# EAGLE design CANreader-FT (EAGLE 7.6.0)
https://github.com/autowp/CANreader
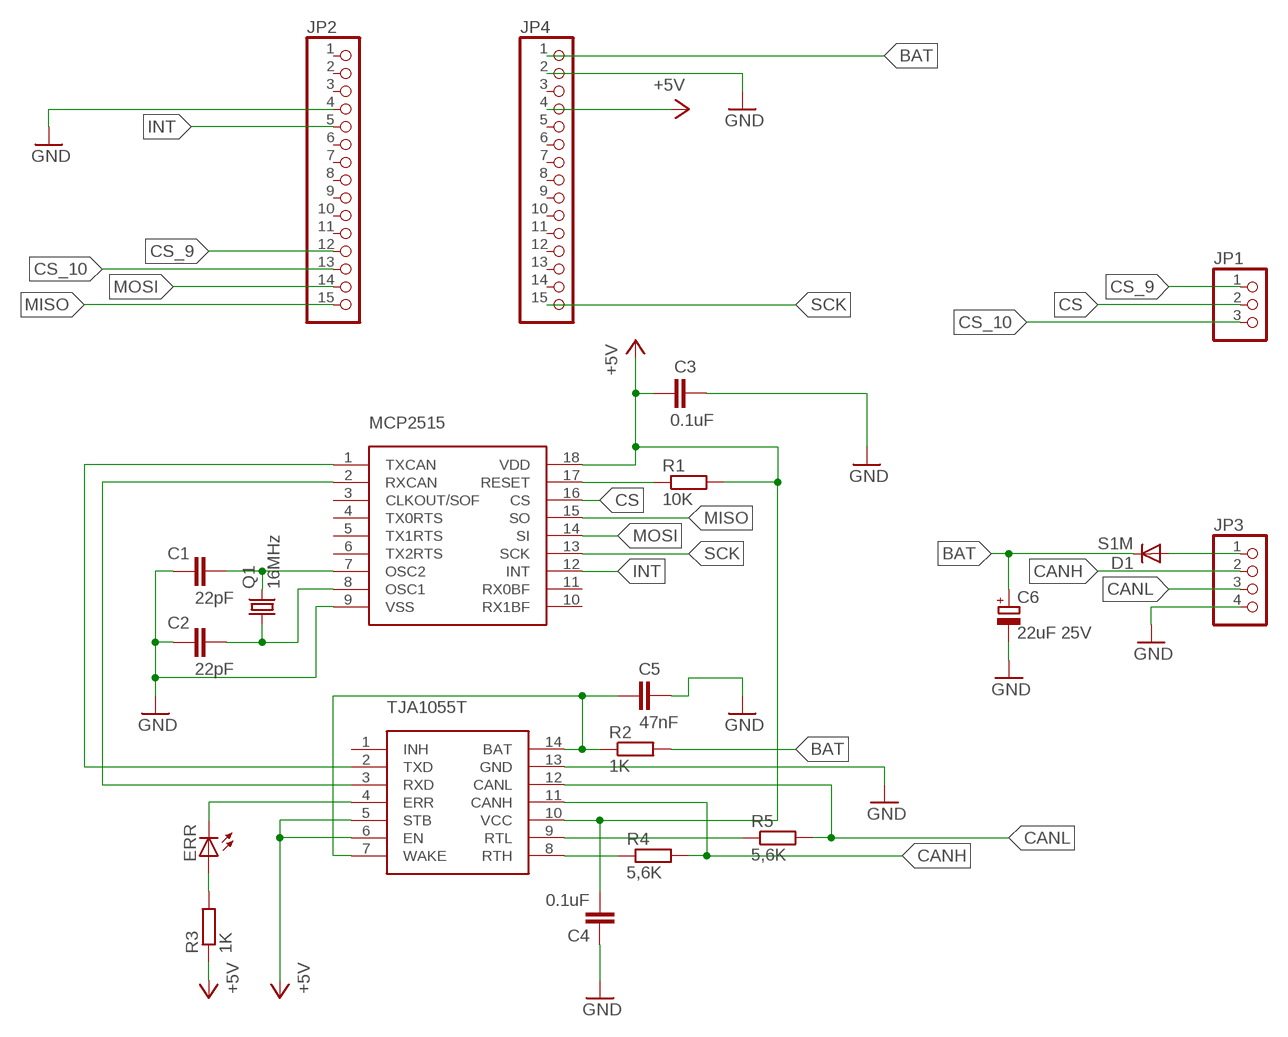
[diagram p0: schematic, sheet 1]

## Parts
C1  22pF  C-EUC0805  [C0805]
C2  22pF  C-EUC0805  [C0805]
C3  0.1uF  C-EUC0805  [C0805]
C4  0.1uF  C-EUC0805  [C0805]
C5  47nF  C-EUC0805  [C0805]
C6  22uF 25V  CPOL-EUSMCC  [SMC_C]
D1  S1M  [SMA]
ERR  LEDCHIP-LED0805  [CHIP-LED0805]
JP1  PINHD-1X3  [1X03]
JP2  PINHD-1X15  [1X15]
JP3  PINHD-1X4-1  [1X04]
JP4  PINHD-1X15  [1X15]
MCP2515  MCP2515  [SO18-1]
Q1  16MHz  CRYSTALHC49S  [HC49/S]
R1  10K  R-EU_R0805  [R0805]
R2  1K  R-EU_R0805  [R0805]
R3  1K  R-EU_R0805  [R0805]
R4  5,6K  R-EU_R0805  [R0805]
R5  5,6K  R-EU_R0805  [R0805]
TJA1055T  TJA1055T  [SO-14W]

## Nets
+5V: C3.1 C4.2 JP4.4 MCP2515.18(VDD) R1.2 R3.1 TJA1055T.5(STB) TJA1055T.6(EN) TJA1055T.10(VCC)
BAT: C6.+ D1.C JP4.1 R2.2
CANH: JP3.2 R4.2 TJA1055T.11(CANH)
CANL: JP3.3 R5.2 TJA1055T.12(CANL)
CS: JP1.2 MCP2515.16(CS)
CS_9: JP1.1 JP2.12
CS_10: JP1.3 JP2.13
GND: C1.1 C2.1 C3.2 C4.1 C5.2 C6.- JP2.4 JP3.4 JP4.2 MCP2515.9(VSS) TJA1055T.13(GND)
INT: JP2.5 MCP2515.12(INT)
MISO: JP2.15 MCP2515.15(SO)
MOSI: JP2.14 MCP2515.14(SI)
N$1: MCP2515.1(TXCAN) TJA1055T.2(TXD)
N$2: MCP2515.2(RXCAN) TJA1055T.3(RXD)
N$3: C1.2 MCP2515.7(OSC2) Q1.2
N$4: D1.A JP3.1
N$5: C2.2 MCP2515.8(OSC1) Q1.1
N$6: C5.1 R2.1 TJA1055T.7(WAKE) TJA1055T.14(BAT)
N$7: MCP2515.17(RESET) R1.1
N$8: R4.1 TJA1055T.8(RTH)
N$9: R5.1 TJA1055T.9(RTL)
N$10: ERR.C TJA1055T.4(ERR)
N$11: ERR.A R3.2
SCK: JP4.15 MCP2515.13(SCK)
Unconnected: JP2.1 JP2.2 JP2.3 JP2.6 JP2.7 JP2.8 JP2.9 JP2.10 JP2.11 JP4.3 JP4.5 JP4.6 JP4.7 JP4.8 JP4.9 JP4.10 JP4.11 JP4.12 JP4.13 JP4.14 MCP2515.3(CLKOUT/SOF) MCP2515.4(TX0RTS) MCP2515.5(TX1RTS) MCP2515.6(TX2RTS) MCP2515.10(RX1BF) MCP2515.11(RX0BF) TJA1055T.1(INH)

## Library data of the parts
C1-C5 = rcl:C-EU: CAPACITOR, European symbol
C6 = rcl:CPOL-EU: POLARIZED CAPACITOR, European symbol
D1 = diode:S1M
ERR = led:LED: LED OSRAM: - CHIPLED LG R971, LG N971, LY N971, LG Q971, LY Q971, LO R971, LY R971 LH N974, LH R974 LS Q976, LO Q976, LY Q976 LO Q996 - Hyper CHIPLED LW Q18S LB Q993, LB Q99A, LB R99A - SideLED LS A670, LO A670, LY A670, LG A670, LP A670 LB A673, LV A673, LT A673, LW A673 LH A674 LY A675 LS A676, LA A676, LO A676, LY A676, LW A676 LS A679, LY A679, LG A679 - Hyper Micro SIDELED® LS Y876, LA Y876, LO Y876, LY Y876 LT Y87S - SmartLED LW L88C, LW L88S LB L89C, LB L89S, LG L890 LS L89K, LO L89K, LY L89K LS L896, LA L896, LO L896, LY L896 - TOPLED LS T670, LO T670, LY T670, LG T670, LP T670 LSG T670, LSP T670, LSY T670, LOP T670, LYG T670 LG T671, LOG T671, LSG T671 LB T673, LV T673, LT T673, LW T673 LH T674 LS T676, LA T676, LO T676, LY T676, LB T676, LH T676, LSB T676, LW T676 LB T67C, LV T67C, LT T67C, LS T67K, LO T67K, LY T67K, LW E67C LS E67B, LA E67B, LO E67B, LY E67B, LB E67C, LV E67C, LT E67C LW T67C LS T679, LY T679, LG T679 LS T770, LO T770, LY T770, LG T770, LP T770 LB T773, LV T773, LT T773, LW T773 LH T774 LS E675, LA E675, LY E675, LS T675 LS T776, LA T776, LO T776, LY T776, LB T776 LHGB T686 LT T68C, LB T68C - Hyper Mini TOPLED® LB M676 - Mini TOPLED Santana® LG M470 LS M47K, LO M47K, LY M47K Source: http://www.osram.convergy.de LUXEON: - LUMILED® LXK2-PW12-R00, LXK2-PW12-S00, LXK2-PW14-U00, LXK2-PW14-V00 LXK2-PM12-R00, LXK2-PM12-S00, LXK2-PM14-U00 LXK2-PE12-Q00, LXK2-PE12-R00, LXK2-PE12-S00, LXK2-PE14-T00, LXK2-PE14-U00 LXK2-PB12-K00, LXK2-PB12-L00, LXK2-PB12-M00, LXK2-PB14-N00, LXK2-PB14-P00, LXK2-PB14-Q00 LXK2-PR12-L00, LXK2-PR12-M00, LXK2-PR14-Q00, LXK2-PR14-R00 LXK2-PD12-Q00, LXK2-PD12-R00, LXK2-PD12-S00 LXK2-PH12-R00, LXK2-PH12-S00 LXK2-PL12-P00, LXK2-PL12-Q00, LXK2-PL12-R00 Source: www.luxeon.com KINGBRIGHT: KA-3528ASYC Source: www.kingbright.com
JP1 = CAN_Shiel_Lib:PINHD-1X3: PIN HEADER
JP2 JP4 = CAN_Shiel_Lib:PINHD-1X15: PIN HEADER
JP3 = CAN_Shiel_Lib:PINHD-1X4-1: PIN HEADER
MCP2515 = CAN_Shiel_Lib:MCP2515
Q1 = crystal:CRYSTAL: CRYSTAL; OC_FARNELL: 1667008; OC_NEWARK: unknown
R1-R5 = rcl:R-EU_: RESISTOR, European symbol
TJA1055T = CAN_Shiel_Lib:TJA1055T

## Board
https://github.com/autowp/CANreader
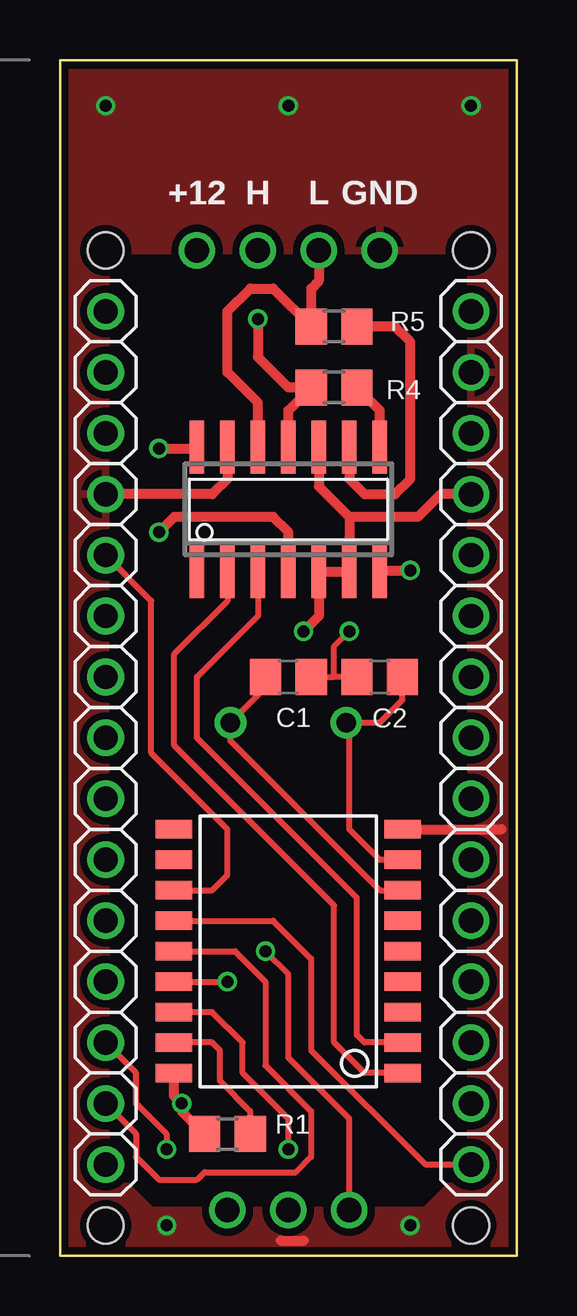
[diagram p1: board, top side]
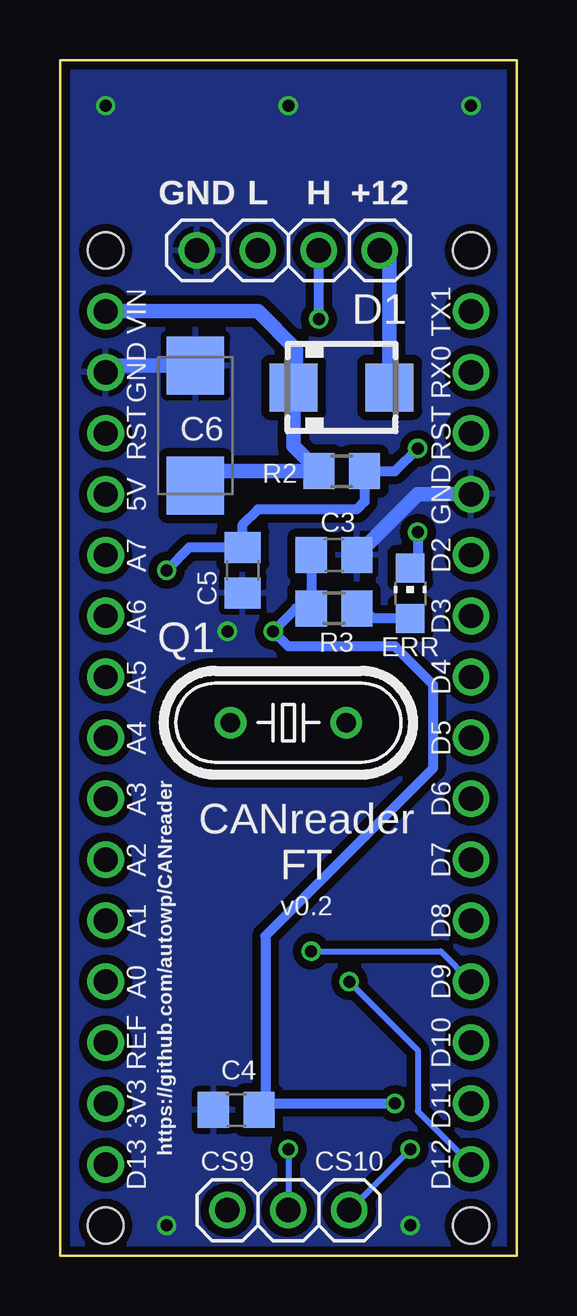
[diagram p2: board, bottom side, seen from below]

Size 19.05 x 49.85 mm. Coordinates in mm from the lower left corner, seen from the top.
Outline: 19.05,0 0,0 0,49.85 19.05,49.85 19.05,0
Copper layers (1*16): Top 0.035mm / dielectric 1.5mm / Bottom 0.035mm
Design rules "ITEADstudio_DRC": minimum track width 6mil, minimum drill 12mil, track to track 6mil, track to pad 6mil, pad to pad 6mil, via to via 6mil, smd to smd 0mil, copper to edge 10mil, drill to drill 10mil, minimum pad ring 10mil, minimum via ring 6mil, stop-mask expansion 2mil, vias tented up to drill 100mil, thermal gap 10mil
Holes 1.5 mm at 1.91,1.27 17.15,1.27 17.15,41.91 1.91,41.91
bRestrict: 4 lines

### Footprints (pad centres in the part's own frame; a part is rotated, then mirrored left to right if it is on the bottom)
C0805 = smd 1.3 x 1.5: 1 -0.95,0; 2 0.95,0
SMC_C = smd 2.4 x 2.4: + -2.5,0; - 2.5,0
SMA = smd 2 x 2: A 2,0; C -2,0
CHIP-LED0805 = smd 1.2 x 1.2: A 0,-1.05; C 0,1.05
1X03 = drill 1.016: 1 -2.54,0; 2 0,0; 3 2.54,0
1X15 = drill 1.016: 1 -17.78,0; 2 -15.24,0; 3 -12.7,0; 4 -10.16,0; 5 -7.62,0; 6 -5.08,0; 7 -2.54,0; 8 0,0; 9 2.54,0; 10 5.08,0; 11 7.62,0; 12 10.16,0; 13 12.7,0; 14 15.24,0; 15 17.78,0
1X04 = drill 1.016: 1 -3.81,0; 2 -1.27,0; 3 1.27,0; 4 3.81,0
SO18-1 = smd 0.762 x 1.524: 1 -5.08,-4.775; 2 -3.81,-4.775; 3 -2.54,-4.775; 4 -1.27,-4.775; 5 0,-4.775; 6 1.27,-4.775; 7 2.54,-4.775; 8 3.81,-4.775; 9 5.08,-4.775; 10 5.08,4.775; 11 3.81,4.775; 12 2.54,4.775; 13 1.27,4.775; 14 0,4.775; 15 -1.27,4.775; 16 -2.54,4.775; 17 -3.81,4.775; 18 -5.08,4.775
HC49/S = drill 0.813: 1 -2.413,0; 2 2.413,0
R0805 = smd 1.3 x 1.5: 1 -0.95,0; 2 0.95,0
SO-14W = smd 0.6 x 2.2: 1 -3.81,-2.6; 2 -2.54,-2.6; 3 -1.27,-2.6; 4 0,-2.6; 5 1.27,-2.6; 6 2.54,-2.6; 7 3.81,-2.6; 8 3.81,2.6; 9 2.54,2.6; 10 1.27,2.6; 11 0,2.6; 12 -1.27,2.6; 13 -2.54,2.6; 14 -3.81,2.6

### Placement (x,y rotation side)
C1  9.52,24.13 180 top
C2  13.34,24.13 0 top
C3  7.62,29.21 0 bottom
C4  11.7,6.08 0 bottom
C5  11.43,28.58 270 bottom
C6  13.4,34.61 90 bottom
D1  7.3,36.2 0 bottom
ERR  4.45,27.62 0 bottom
JP1  9.52,1.91 0 bottom
JP2  1.91,21.59 270 top
JP3  9.52,41.91 180 bottom
JP4  17.15,21.59 270 top
MCP2515  9.52,12.7 90 top
Q1  9.52,22.23 0 bottom
R1  6.98,5.08 180 top
R2  7.3,32.7 180 bottom
R3  7.62,26.99 0 bottom
R4  11.43,36.2 180 top
R5  11.43,38.73 180 top
TJA1055T  9.52,31.12 0 top

### Tracks (layer width: path | path; a pad name or v marks a point on that pad's centre or on a via)
+5V  (via drill 0.5)
  Top 0.406: TJA1055T.10 10.8,32.07 12.06,30.8 | 12.06,30.8 TJA1055T.6 TJA1055T.5 10.8,26.67 v10.16,26.03 | 12.06,30.8 14.92,30.8 15.88,31.75 JP4.4 | MCP2515.18 4.75,6.68 v5.08,6.35 5.08,6.04 R1.2
  Bottom 0.406: 10.48,6.35 v5.08,6.35 | C4.2 10.48,6.35 | 10.48,6.35 10.48,13.33 3.49,20.32 3.49,23.81 5.08,25.4 9.52,25.4 v10.16,26.03 9.21,26.99 R3.1 C3.1
BAT
  Bottom 0.61: D1.C 9.52,36.2 | JP4.1 10.8,39.37 9.21,37.78 9.21,36.29 D1.C | D1.C 9.3,33.75 R2.2 13.06,32.7 C6.+
CANH  (via drill 0.5)
  Top 0.406: TJA1055T.11 9.52,35.24 R4.2 9.52,36.2 8.26,37.46 v8.26,39.05
  Bottom 0.406: v8.26,39.05 JP3.2
CANL
  Top 0.406: TJA1055T.12 8.26,35.56 6.98,36.83 6.98,39.37 7.94,40.32 8.89,40.32 R5.2 10.48,40.33 10.8,40.64 JP3.3
CS  (via drill 0.5)
  Top 0.254: v9.52,4.45 9.52,5.71 7.62,7.62 7.62,8.89 6.35,10.16 MCP2515.16
  Bottom 0.254: v9.52,4.45 JP1.2
CS_9  (via drill 0.5)
  Top 0.254: JP1.1 12.06,5.71 9.52,8.25 9.52,11.75 v8.57,12.7
  Bottom 0.254: v8.57,12.7 3.17,12.7 JP2.12
CS_10  (via drill 0.5)
  Top 0.254: JP2.13 3.17,7.62 3.17,6.35 4.45,5.08 v4.45,4.45
  Bottom 0.254: JP1.3 v4.45,4.45
GND  (via drill 0.5)
  Top 0.254: C2.1 11.43,24.13 | 11.43,24.13 11.43,25.4 v12.06,26.03 | C1.1 11.43,24.13
  Top 0.406: MCP2515.9 18.41,17.78 | TJA1055T.13 6.98,32.38 6.35,31.75 JP2.4 | 9.21,0.63 10.16,0.63
  Bottom 0.61: JP2.4 4.13,31.75 6.35,29.52 C3.2 | C6.- 16.87,37.11 JP4.2
  other vias: 14.61,1.27 4.45,1.27 17.15,47.94 1.91,47.94 9.52,47.94
  pour Top (isolate 0.305): 9.84,-1.27 20.95,-1.27 20.95,50.48 -1.91,50.48 -1.91,-1.27 9.52,-1.27 9.52,1.91 3.81,1.91 1.91,3.81 1.91,41.91 17.15,41.91 17.15,3.81 15.24,1.91 9.84,1.91
  pour Bottom (isolate 0.35): 23.49,-3.81 23.49,52.07 -5.71,52.07 -5.71,-3.81
INT
  Top 0.254: JP2.5 3.81,27.3 3.81,20.95 6.98,17.78 6.98,15.88 6.35,15.24 MCP2515.12
MISO  (via drill 0.5)
  Top 0.254: MCP2515.15 v6.98,11.43
  Bottom 0.254: v6.98,11.43 4.13,8.57 4.13,6.03 JP2.15
MOSI
  Top 0.254: MCP2515.14 7.3,12.7 8.57,11.43 8.57,7.94 10.48,6.03 10.48,4.13 9.84,3.49 6.03,3.49 5.72,3.18 4.13,3.18 3.17,4.13 3.17,5.08 JP2.14
N$1
  Top 0.254: MCP2515.1 12.7,7.62 11.43,8.89 11.43,14.6 4.76,21.27 4.76,25.08 6.98,27.3 TJA1055T.2
N$2
  Top 0.254: MCP2515.2 12.7,8.89 12.38,9.21 12.38,14.92 5.72,21.59 5.72,24.13 8.26,26.67 TJA1055T.3
N$3
  Top 0.254: MCP2515.7 13.34,15.24 7.11,21.46 Q1.2 8.58,23.69 C1.2
N$4
  Bottom 0.61: D1.A 5.3,41.5 JP3.1
N$5
  Top 0.254: MCP2515.8 13.34,16.51 12.06,17.78 12.06,21.72 Q1.1 13.34,22.23 14.29,23.17 C2.2
N$6  (via drill 0.5)
  Top 0.406: TJA1055T.7 13.4,28.58 v14.61,28.58 | v4.13,33.66 5.66,33.66 TJA1055T.14
  Bottom 0.406: v14.6,28.58 v14.61,28.58 13.66,29.52 C5.1 11.43,30.48 10.8,31.12 6.67,31.12 6.35,31.43 R2.1 5.08,32.7 v4.13,33.66
N$7
  Top 0.254: R1.1 7.94,6.04 6.67,7.3 6.67,8.57 6.35,8.89 MCP2515.17
N$8
  Top 0.406: TJA1055T.8 13.34,35.24 R4.1
N$9
  Top 0.406: TJA1055T.9 12.06,32.38 12.7,31.75 13.97,31.75 14.61,32.38 14.61,38.1 13.97,38.73 R5.1
N$10  (via drill 0.5)
  Top 0.406: TJA1055T.4 9.52,30.16 8.89,30.8 4.76,30.8 v4.13,30.16
  Bottom 0.406: v4.13,30.16 4.13,28.99 ERR.C
N$11
  Bottom 0.406: ERR.A 5.94,26.57 R3.2
SCK
  Top 0.254: MCP2515.13 8.89,13.97 10.48,12.38 10.48,8.57 15.24,3.81 JP4.15

### Text on the board
tPlace: +12 | H | L | GND
bPlace: +12 | H | L | GND | TX1 | VIN | RX0 | GND | RST | RST | GND | 5V | D2 | A7 | D3 | A6 | D4 | A5 | D5 | A4 | https://github.com/autowp/CANreader | D6 | A3 | CANreader / FT | D7 | A2 | v0.2 | D8 | A1 | D9 | A0 | D10 | REF | D11 | 3V3 | D12 | CS10 | CS9 | D13